# EasyEDA Pro project ProPrj_25电赛_2025-08-03-final.epro, schematic Schematic2
Board Name: Board2; Create Date: 2025-07-30; Page Name: P1; Project Name: 25电赛; Schematic Name: Schematic2; Update Date: 2025-07-30; Company: 嘉立创EDA; Page Size: A4; Version: V1.0
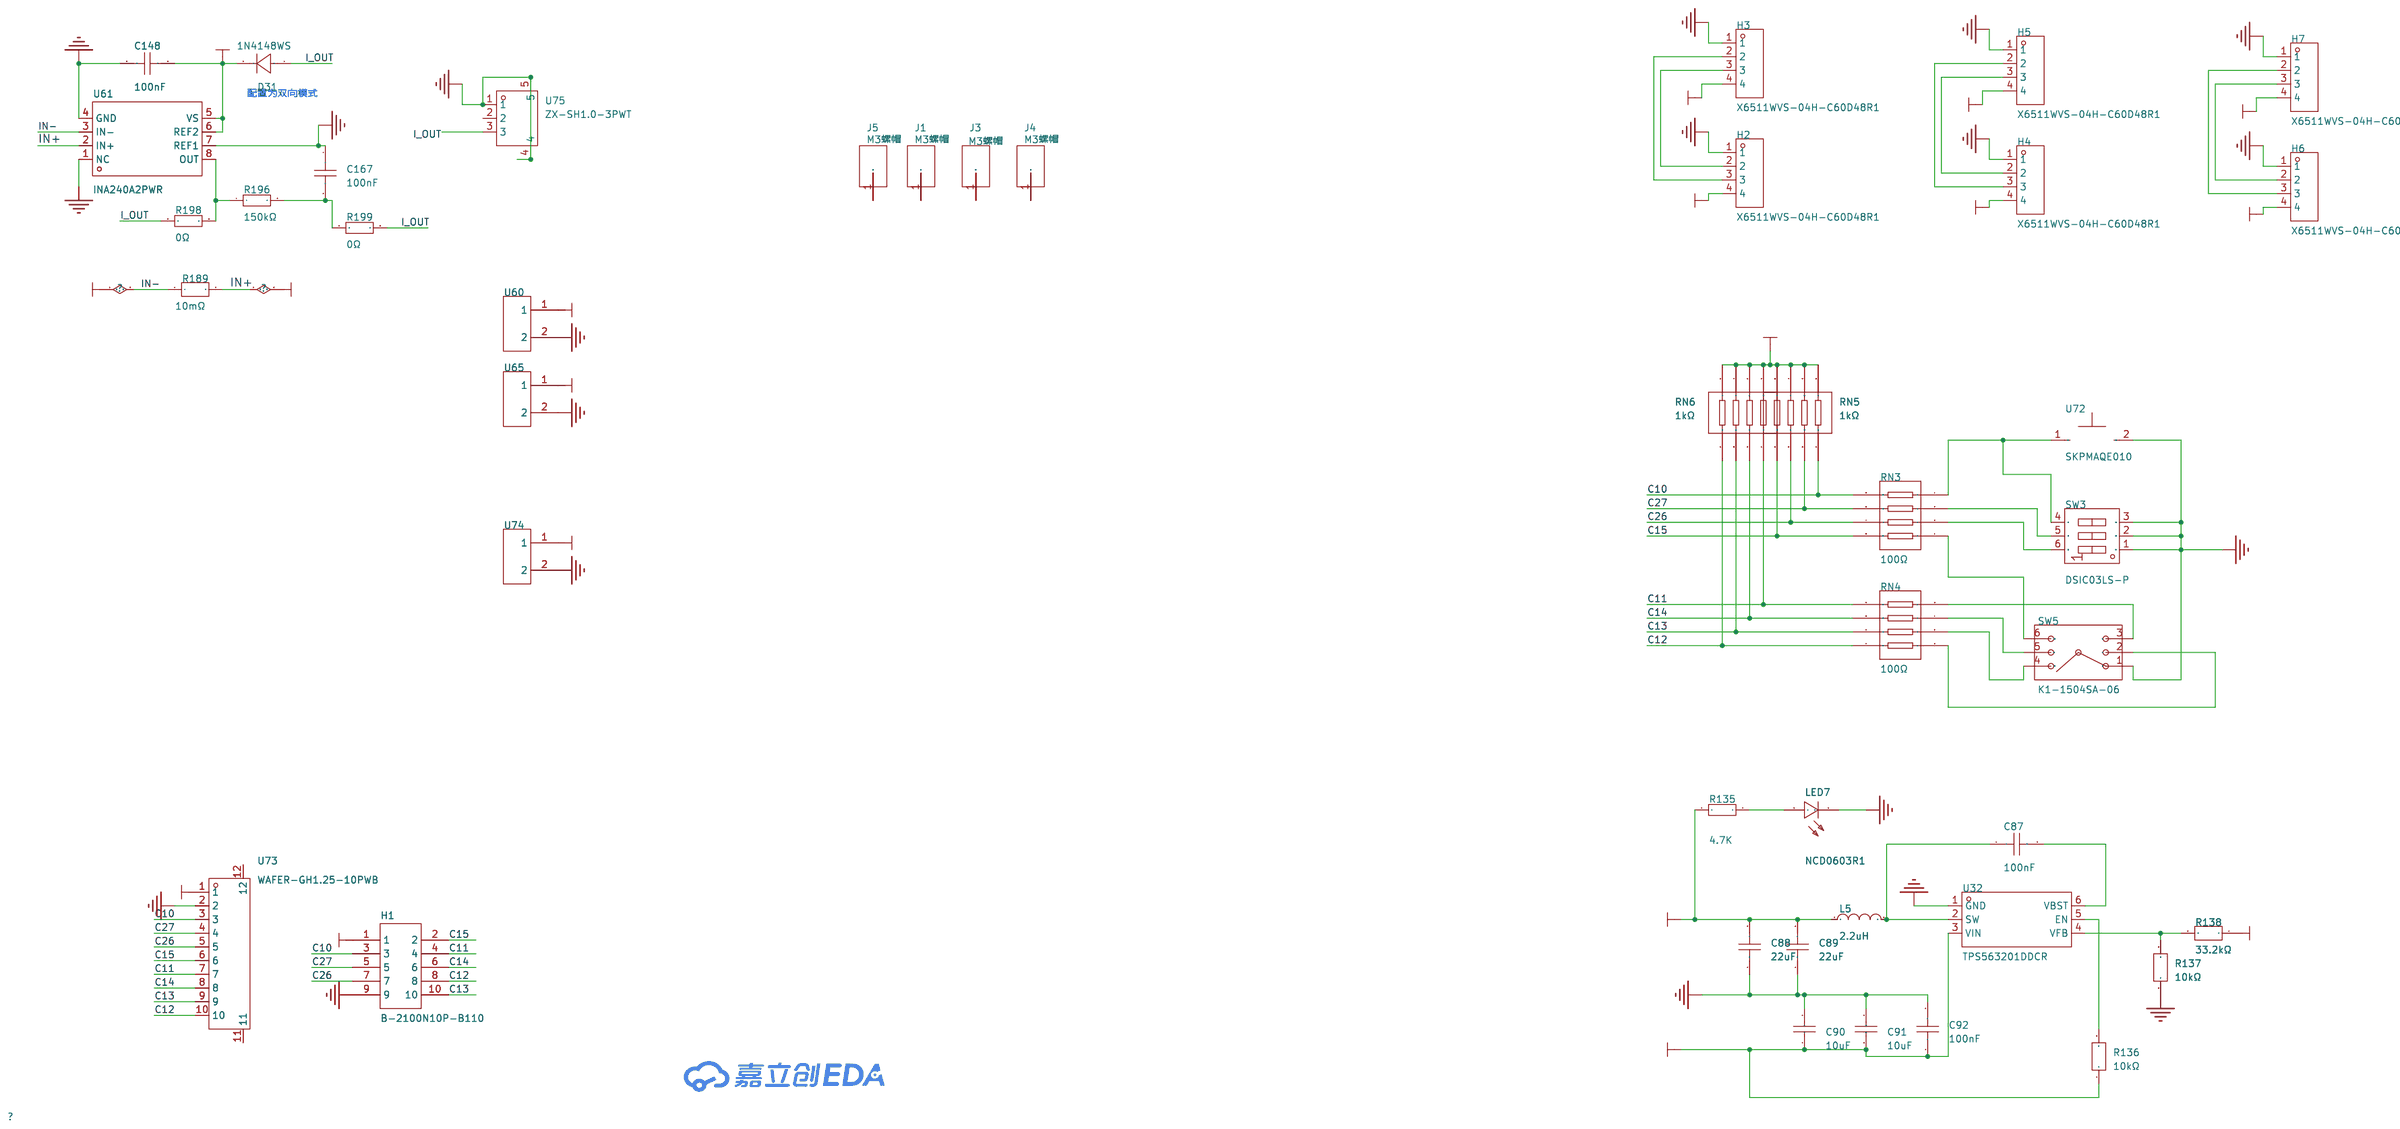
[diagram p0: schematic sheet]

## Parts
C87  100nF  [C0603]
C88  22uF  [C0805]
C89  22uF  [C0805]
C90  10uF  [C0805]
C91  10uF  [C0805]
C92  100nF  [C0603]
C148  100nF  [C0402]
C167  100nF  [C0402]
D31  1N4148WS  [SOD-323_L1.7-W1.3-LS2.5-FD]
H1  B-2100N10P-B110  [HDR-SMD_10P-P2.54-V-M-R2-C5-S2.54-LS7.3]
H2  X6511WVS-04H-C60D48R1  [HDR-SMD_4P-P2.54-V-M-S4.8]
H3  X6511WVS-04H-C60D48R1  [HDR-SMD_4P-P2.54-V-M-S4.8]
H4  X6511WVS-04H-C60D48R1  [HDR-SMD_4P-P2.54-V-M-S4.8]
H5  X6511WVS-04H-C60D48R1  [HDR-SMD_4P-P2.54-V-M-S4.8]
H6  X6511WVS-04H-C60D48R1  [HDR-SMD_4P-P2.54-V-M-S4.8]
H7  X6511WVS-04H-C60D48R1  [HDR-SMD_4P-P2.54-V-M-S4.8]
J1  M3螺帽  [M3螺帽]
J3  M3螺帽  [M3螺帽]
J4  M3螺帽  [M3螺帽]
J5  M3螺帽  [M3螺帽]
L5  2.2uH  [IND-SMD_L2.5-W2.0_MHCHL2520]
LED7  NCD0603R1  [LED0603-RD_RED]
R135  4.7K  [R0603]
R136  10kΩ  [R0603]
R137  10kΩ  [R0603]
R138  33.2kΩ  [R0603]
R189  10mΩ  [R1206]
R196  150kΩ  [R0402]
R198  0Ω  [R0603]
R199  0Ω  [R0603]
RN3  100Ω  [RES-ARRAY-SMD_0603-8P-L3.2-W1.6-BL]
RN4  100Ω  [RES-ARRAY-SMD_0603-8P-L3.2-W1.6-BL]
RN5  1kΩ  [RES-ARRAY-SMD_0603-8P-L3.2-W1.6-BL]
RN6  1kΩ  [RES-ARRAY-SMD_0603-8P-L3.2-W1.6-BL]
SW3  DSIC03LS-P  [SW-SMD_6P-L8.6-W6.2-P2.54-LS9.8]
SW5  K1-1504SA-06  [SW-SMD_K1-1504SA-06]
U32  TPS563201DDCR  [SOT-23-6_L2.9-W1.6-P0.95-LS2.8-BR]
U60  -  [2P焊接端子（大电流）]
U61  INA240A2PWR  [TSSOP-8_L4.4-W3.0-P0.65-LS6.4-BL]
U65  -  [2P焊接端子（大电流）]
U72  SKPMAQE010  [KEY-SMD_2P-L6.0-W6.0-P6.00]
U73  WAFER-GH1.25-10PWB  [CONN-SMD_10P-P1.25_XUNPU_WAFER-GH1.25-10PWB]
U74  -  [2P焊接端子（大电流）]
U75  ZX-SH1.0-3PWT  [CONN-SMD_3P-P1.00_MEGASTAR_ZX-SH1.0-3PWT]

## Library data of the parts
C87 C92 = CGA0603X7R104K500JT: 容值:100nF;精度:±10%;额定电压:50V;材质(温度系数):X7R;; LCSC Part Name: 100nF ±10% 50V; Supplier Part: C6119867; Manufacturer: HRE(芯声); Supplier Footprint: 0603; JLCPCB Part Class: 扩展库; Supplier: LCSC; Tolerance: ±10%; Voltage Rated: 50V; Temperature Coefficient: X7R
C88 C89 = CGA0805X5R226M350MT: 容值:22uF;精度:±20%;额定电压:35V;材质(温度系数):X5R;; LCSC Part Name: 22uF ±20% 35V; Supplier Part: C6119901; Manufacturer: HRE(芯声); Supplier Footprint: 0805; JLCPCB Part Class: 扩展库; Datasheet: https://atta.szlcsc.com/upload/public/pdf/source/20231129/D589D0CC4D260F7AC3A77E53B455CCB3.pdf; Supplier: LCSC; Tolerance: ±20%; Voltage Rated: 35V; Temperature Coefficient: X5R
C90 C91 = CL21A106KPFNNNE: 容值:10uF;精度:±10%;额定电压:10V;材质(温度系数):X5R;; LCSC Part Name: 10uF ±10% 10V; Supplier Part: C17024; Manufacturer: SAMSUNG(三星); Supplier Footprint: 0805; JLCPCB Part Class: 扩展库; Datasheet: https://atta.szlcsc.com/upload/public/pdf/source/20160218/1457707763339.pdf; Supplier: LCSC; Tolerance: ±10%; Voltage Rated: 10V; Temperature Coefficient: X5R
C148 C167 = CL05B104KB54PNC: 容值:100nF;精度:±10%;额定电压:50V;材质(温度系数):X7R;; LCSC Part Name: 100nF ±10% 50V; Supplier Part: C307331; Manufacturer: SAMSUNG(三星); Supplier Footprint: 0402; JLCPCB Part Class: 基础库; Datasheet: https://atta.szlcsc.com/upload/public/pdf/source/20160218/1457707763339.pdf; Supplier: LCSC; Tolerance: ±10%; Voltage Rated: 50V; Temperature Coefficient: X7R
D31 = 1N4148WS_C7420319: 二极管配置:独立式;正向压降(Vf):1.25V@150mA;直流反向耐压(Vr):100V;整流电流:150mA;反向恢复时间(trr):4ns;; Supplier Part: C7420319; Manufacturer: 宏迦橙; Supplier Footprint: SOD-323; JLCPCB Part Class: 扩展库; Datasheet: https://atta.szlcsc.com/upload/public/pdf/source/20240228/ACAE8A2B901F2FD417588BC59863BC16.pdf; Supplier: LCSC; Diode Configuration: 独立式; Forward Voltage (Vf@If): 1.25V@150mA; Reverse Voltage (Vr): 100V; Rectified Current: 150mA; Reverse Leakage Current (Ir): 1uA@75V; Reverse Recovery Time (trr): 4ns; Operating Temperature: -55℃~+150℃
H1 = B-2100N10P-B110: 插针结构:2x5P;间距:2.54mm;行距:2.54mm;圆针/方针:方针;安装方式:立贴;排数:双排;总PIN位数:10P;额定电流:-;额定电压:-;配合针长度:6mm;塑高:2mm;触头材质:黄铜;触头镀层:-;工作温度:-40℃~+105℃;颜色:黑色;; LCSC Part Name: 2x5P 间距:2.54mm 方针 立贴; Supplier Part: C124391; Manufacturer: Ckmtw(灿科盟); Supplier Footprint: SMD,P=2.54mm; JLCPCB Part Class: 扩展库; Datasheet: https://atta.szlcsc.com/upload/public/pdf/source/20170821/C124391_1503303314915901545.pdf; Supplier: LCSC; Pin Structure: 2x5P; Pitch: 2.54mm; Row Spacing: 2.54mm; Circluar Pins/Square Pins: 方针; Mounting Type: 立贴; Number of Rows: 双排; Number of Pins: 10P; Length of Mating Pin: 6mm; Insulation Height: 2mm; Contact Material: 黄铜; Operating Temperature: -40℃~+105℃; Color: 黑色
H2-H7 = X6511WVS-04H-C60D48R1: 插针结构:1x4P;间距:2.54mm;行距:2.54mm;圆针/方针:方针;安装类型:-;排数:单排;总PIN位数:4P;额定电流:3A;额定电压:250V;配合针长度:-;塑高:2.5mm;端接针长度:-;触头材质:黄铜;触头镀层:金;工作温度范围:-40℃~+105℃;焊接温度(最大值):260℃;颜色:黑色;; LCSC Part Name: 1x4P 间距:2.54mm 方针; Supplier Part: C780062; Manufacturer: XKB Connection(中国星坤); Supplier Footprint: SMD,P=2.54mm; JLCPCB Part Class: 扩展库; Datasheet: https://atta.szlcsc.com/upload/public/pdf/source/20220804/E423AB74ABBD410F84642849337C77AB.pdf; Supplier: LCSC; Pin Structure: 1x4P; Pitch: 2.54mm; Row Spacing: 2.54mm; Circluar Pins/Square Pins: 方针; Number of Rows: 单排; Number of Pins: 4P; Current Rating (Max): 3A; Voltage Rating (Max): 250V; Insulation Height: 2.5mm; Contact Material: 黄铜; Contact Plating: 金; Operating Temperature Range: -40℃~+105℃; Soldering Temperature(Max): 260℃; Color: 黑色
J1 J3-J5 = M3螺帽
L5 = FTC252012S2R2MBCA: 电感值:2.2uH;精度:±20%;额定电流:3A;饱和电流(Isat):3.8A;类型:一体成型电感;; LCSC Part Name: 2.2uH ±20% 3.8A; Supplier Part: C5832372; Manufacturer: cjiang(长江微电); Supplier Footprint: 1008; JLCPCB Part Class: 扩展库; Datasheet: https://atta.szlcsc.com/upload/public/pdf/source/20230602/8FFEDA9C0247A92A0D4B67554BFE4091.pdf; Supplier: LCSC; Tolerance: ±20%; Rated Current: 3A; Saturation Current (Isat): 3.8A; DC Resistance (DCR): 55mΩ; Type: 一体成型电感
LED7 = NCD0603R1_C84263: 灯头类型:-;发光颜色:红色;正向电压(VF):1.6V~2.6V;功率:65mW;正向电流:20mA;主波长:615nm~630nm;二极管配置:独立二极管;透镜颜色:无色透明透镜;色温:-;发光强度:80mcd~220mcd;发光角度:130°;载带方式:-;工作温度:-30℃~+85℃;; Supplier Part: C84263; Manufacturer: 国星光电; Supplier Footprint: 0603; JLCPCB Part Class: 扩展库; Datasheet: https://atta.szlcsc.com/upload/public/pdf/source/20200820/C84263_DABC6A75E58F576973B407FDBA283D60.pdf; Supplier: LCSC; Emitted Color: 红色; Forward Voltage (VF): 1.6V~2.6V; Power Dissipation: 65mW; Forward Current: 20mA; Dominant Wavelength: 615nm~630nm; Diode Configuration: 独立二极管; Lens Color: 无色透明透镜; Luminous Intensity: 80mcd~220mcd; Viewing Angle: 130°; Operating Temperature: -30℃~+85℃
R135 = Res_0603: Supplier Footprint: 0603
R136-R138 = FRC0603J103TS: 电阻类型:厚膜电阻;阻值:10kΩ;精度:±5%;功率:100mW;最大工作电压:75V;温度系数:±100ppm/℃;; LCSC Part Name: 10kΩ ±5% 100mW 厚膜电阻; Supplier Part: C2930027; Manufacturer: FOJAN(富捷); Supplier Footprint: 0603; JLCPCB Part Class: 扩展库; Datasheet: https://atta.szlcsc.com/upload/public/pdf/source/20211221/925EC7D7225764EE0046F22065062C87.pdf; Supplier: LCSC; Type: 厚膜电阻; Tolerance: ±5%; Power(Watts): 100mW; Overload Voltage (Max): 75V; Temperature Coefficient: ±100ppm/℃; Operating Temperature Range: -55℃~+155℃
R189 = JER1206F1R010: 电阻类型:采样电阻;阻值:10mΩ;精度:±1%;功率:1W;温度系数:±50ppm/℃;; LCSC Part Name: 10mΩ 1W 1206 ±1%; Supplier Part: C46634437; Manufacturer: 捷而瑞; Supplier Footprint: 1206; JLCPCB Part Class: 扩展库; Datasheet: https://atta.szlcsc.com/upload/public/pdf/source/20250318/D554CC95569B02A455FAE3D181D671EA.pdf; Supplier: LCSC; Type: 采样电阻; Tolerance: ±1%; Power(Watts): 1W; Temperature Coefficient: ±50ppm/℃
R196 = 0402WGF1503TCE: 电阻类型:厚膜电阻;阻值:150kΩ;精度:±1%;功率:62.5mW;最大工作电压:50V;温度系数:±100ppm/℃;; LCSC Part Name: 150kΩ ±1% 62.5mW 厚膜电阻; Supplier Part: C25755; Manufacturer: UNI-ROYAL(厚声); Supplier Footprint: 0402; JLCPCB Part Class: 扩展库; Datasheet: https://atta.szlcsc.com/upload/public/pdf/source/20200306/C422600_1E6D84923E4A46A82E41ADD87F860B5C.pdf; Supplier: LCSC; Type: 厚膜电阻; Tolerance: ±1%; Power(Watts): 62.5mW; Overload Voltage (Max): 50V; Temperature Coefficient: ±100ppm/℃; Operating Temperature Range: -55℃~+155℃
R198 R199 = 0603WAF0000T5E: 电阻类型:厚膜电阻;阻值:0Ω;精度:±1%;功率:100mW;工作电压:75V;; LCSC Part Name: 0Ω ±1% 100mW 厚膜电阻; Supplier Part: C21189; Manufacturer: UNI-ROYAL(厚声); Supplier Footprint: 0603; JLCPCB Part Class: 基础库; Datasheet: https://atta.szlcsc.com/upload/public/pdf/source/20200306/C422600_1E6D84923E4A46A82E41ADD87F860B5C.pdf; Supplier: LCSC; Type: 厚膜电阻; Tolerance: ±1%; Power(Watts): 100mW; Voltage-Supply(Max): 75V; Operating Temperature: -55℃~+155℃
RN3 RN4 = 4D03WGJ0101T5E: 电阻器数:4;阻值:100Ω;精度:±5%;单个元件功率:62.5mW;温度系数:±200ppm/℃;; LCSC Part Name: 100Ω ±5%; Supplier Part: C25506; Manufacturer: UNI-ROYAL(厚声); Supplier Footprint: 0603x4; JLCPCB Part Class: Extended Part; Datasheet: https://atta.szlcsc.com/upload/public/pdf/source/20191224/C474318_2527498AE30E813171187CCD28401A71.pdf; Supplier: LCSC; Number of Resistors: 4; Tolerance: ±5%; Power(Watts): 62.5mW; Temperature Coefficient: ±200ppm/℃; Number of Pins: 8
RN5 RN6 = 4D03WGJ0102T5E: 电阻器数:4;阻值:1kΩ;精度:±5%;单个元件功率:62.5mW;温度系数:±200ppm/℃;; LCSC Part Name: 1kΩ ±5%; Supplier Part: C20197; Manufacturer: UNI-ROYAL(厚声); Supplier Footprint: 0603x4; JLCPCB Part Class: 基础库; Datasheet: https://atta.szlcsc.com/upload/public/pdf/source/20191224/C474318_2527498AE30E813171187CCD28401A71.pdf; Supplier: LCSC; Number of Resistors: 4; Tolerance: ±5%; Power(Watts): 62.5mW; Temperature Coefficient: ±200ppm/℃; Number of Pins: 8
SW3 = DSIC03LS-P: 类型:平拨,凸起式;电路结构:单刀单掷;开关位数:3位;额定电流:25mA;额定电压:24V;使用寿命:3千次;颜色:黑色;; LCSC Part Name: 间距2.54mm 平拨,凸起式 3位拨码开关; Supplier Part: C319040; Manufacturer: XKB Connectivity(中国星坤); Supplier Footprint: SMD-6P,6x7.6mm; JLCPCB Part Class: 扩展库; Datasheet: https://atta.szlcsc.com/upload/public/pdf/source/20211009/004AD184124B4CBFBB0B4AFFEA8A3CC9.pdf; Supplier: LCSC; Type: 平拨,凸起式; Circuit: 单刀单掷; Number of Positions: 3位; Pin Style: 鸥翼型; Lead Pitch: 2.54mm; Current Rating: 25mA; Voltage Rating: 24V; Operating Temperature: -20℃~+70℃; Operating Life: 3千次; Color: 黑色
SW5 = K1-1504SA-06: Supplier Part: C136712; Manufacturer: 韩国韩荣; Supplier Footprint: SMD,10x10mm; JLCPCB Part Class: 扩展库; Datasheet: https://atta.szlcsc.com/upload/public/pdf/source/20210810/C19E165DEB2C09DE28F28226FC5359B8.pdf; Supplier: LCSC
U32 = TPS563201DDCR: 功能类型:降压型;输出类型:可调;输入电压:4.5V~17V;输出电压:768mV~7V;输出电流:3A;; Supplier Part: C116592; Manufacturer: TI(德州仪器); Supplier Footprint: SOT-23-THIN-6; JLCPCB Part Class: 扩展库; Datasheet: https://atta.szlcsc.com/upload/public/pdf/source/20230424/FEEFD13F14AFA838E4C009B2DDC1DFA0.pdf; Supplier: LCSC; Function: 降压型; Output Type: 可调; Input Voltage: 4.5V~17V; Output Voltage: 768mV~7V; Output Current: 3A; Switching Frequency: 580kHz; Operating Temperature: -40℃~+125℃@(TJ); Synchronous Rectification: 是; Number of Outputs: 1; Topology: 降压式; Switch tube (built-in/external): 内置
U60 U65 U74 = 大电流焊接端子
U61 = INA240A2PWR: 放大器数:单路;; Supplier Part: C129949; Manufacturer: TI(德州仪器); Supplier Footprint: TSSOP-8; JLCPCB Part Class: 扩展库; Datasheet: https://www.ti.com/cn/lit/gpn/ina240; Supplier: LCSC; Number of Channels: 单路; Supply Current: 1.8mA; Operating Temperature: -40℃~+125℃
U72 = SKPMAQE010: 6*6*5mm 立贴 硅胶软开关 无声静音开关 电路结构:单刀单掷 触点电流:50mA 额定电压(DC):16V 安装方式:立贴 动作力:3.5N 操作寿命:5万次 行程:1.3mm 用途:汽车音响,汽车导航,音响设备,手持设备,通讯设备,测量仪器等各种操作; Supplier Part: C19274389; Manufacturer: ALPSALPINE(阿尔卑斯阿尔派); Supplier Footprint: SMD,6.6x6mm; JLCPCB Part Class: 扩展库; Datasheet: https://atta.szlcsc.com/upload/public/pdf/source/20231201/D724ADF6978EA66A095344C51B88B412.pdf; Supplier: LCSC
U73 = WAFER-GH1.25-10PWB: 插针结构:1x10P;间距:1.25mm;安装方式:卧贴;参考系列:GH;总PIN数:10P;排数:1;每排PIN数:10;行距:-;额定电流:1A;触头材质:黄铜;触头镀层:-;工作温度范围:-25℃~+85℃;; LCSC Part Name: 1x10P 间距:1.25mm 卧贴 系列:GH; Supplier Part: C3029385; Manufacturer: XUNPU(讯普); Supplier Footprint: SMD,P=1.25mm,卧贴; JLCPCB Part Class: 扩展库; Datasheet: https://atta.szlcsc.com/upload/public/pdf/source/20220527/CB8773BFB0913C3B8ABD62CB38BA101A.pdf; Supplier: LCSC; Pins Structure: 1x10P; Pitch: 1.25mm; Mounting Type: 卧贴; Reference Series: GH; Number of Pins: 10P; Number of Rows: 1; Number of PINs Per Row: 10; Current Rating: 1A; Contact Material: 黄铜; Operating Temperature: -25℃~+85℃; Voltage Rating: 125V; Plastic Material: LCP; Supplementary Features: 辅助焊脚; Color: 米色; Z-Height of the Board: 4.35mm; X-Length of Bottom Edge on Board (Spacing Line): 15.75mm; Y-Width of Bottom Edge on Board: 5mm
U75 = ZX-SH1.0-3PWT: 插针结构:1x3P;间距:1mm;安装方式:卧贴;参考系列:SH;总PIN数:3P;排数:1;每排PIN数:3;行距:-;额定电流:1A;触头材质:黄铜;触头镀层:锡;工作温度:-;; LCSC Part Name: 1x3P 间距:1mm 卧贴 系列:SH; Supplier Part: C7430445; Manufacturer: Megastar(兆星); Supplier Footprint: SMD,P=1mm,卧贴; JLCPCB Part Class: 扩展库; Datasheet: https://atta.szlcsc.com/upload/public/pdf/source/20230619/CFE52D4011A035D5D140AE40938A4C7D.pdf; Supplier: LCSC; Pins Structure: 1x3P; Pitch: 1mm; Mounting Type: 卧贴; Reference Series: SH; Number of Pins: 3P; Number of Rows: 1; Number of PINs Per Row: 3; Current Rating: 1A; Contact Material: 黄铜; Contact Plating: 锡; Voltage Rating: 50V; Plastic Material: LCP; Supplementary Features: 辅助焊脚; Color: 米色; Z-Height of the Board: 3.15mm; X-Length of Bottom Edge on Board (Spacing Line): 5.35mm; Y-Width of Bottom Edge on Board: 5.05mm

## Nets
+5V_IN: R189.2 U61.2(IN+) U74.1
GND: C88.1 C89.1 C90.2 C91.2 C92.2 C148.2 C167.1 H1.9 H2.1 H3.1 H4.1 H5.1 H6.1 H7.1 LED7.1(K) R137.1 SW3.1(PIN1) SW3.2(PIN2) SW3.3(PIN3) SW5.1(A) U32.1(GND) U60.2 U61.1(NC) U61.4(GND) U61.7(REF1) U65.2 U72.2 U73.2 U74.2 U75.1 U75.4 U75.5
VCC_3V3: C88.2 C89.2 C148.1 D31.2(K) H1.1 L5.1 R135.2 R138.1 RN5.5 RN5.6 RN5.7 RN5.8 RN6.5 RN6.6 RN6.7 RN6.8 U60.1 U61.5(VS) U61.6(REF2) U73.1
VCC_5V: C90.1 C91.1 C92.1 H2.4 H3.4 H4.4 H5.4 H6.4 H7.4 R136.1 R189.1 U32.3(VIN) U61.3(IN-) U65.1
C10: H1.3 RN3.5 RN5.4 U73.3
C11: H1.4 RN4.1 RN6.4 U73.7
C12: H1.8 RN4.4 RN6.1 U73.10
C13: H1.10 RN4.3 RN6.2 U73.9
C14: H1.6 RN4.2 RN6.3 U73.8
C15: H1.2 RN3.8 RN5.1 U73.6
C26: H1.7 RN3.7 RN5.2 U73.5
C27: H1.5 RN3.6 RN5.3 U73.4
I_OUT: D31.1(A) R198.1 R199.2 U75.3
$1N2849: R196.1 R198.2 U61.8(OUT)
$1N2863: C167.2 R196.2 R199.1
$1N2955: RN3.4 SW3.4(PIN4) U72.1
$1N2956: RN3.3 SW3.5(PIN5)
$1N2957: RN3.2 SW3.6(PIN6)
$1N2958: RN3.1 SW5.6(COMMON)
$1N2959: RN4.8 SW5.3(C)
$1N2960: RN4.7 SW5.5(D)
$1N2961: RN4.6 SW5.4(CENTER)
$1N2962: RN4.5 SW5.2(B)
$1N3002: H2.3 H3.2
$1N3006: H2.2 H3.3
$1N3063: C87.1 L5.2 U32.2(SW)
$1N3066: LED7.2(A) R135.1
$1N3068: C87.2 U32.6(VBST)
$1N3069: R136.2 U32.5(EN)
$1N3071: R137.2 R138.2 U32.4(VFB)
$1N3291: H4.3 H5.2
$1N3295: H4.2 H5.3
$1N3471: H6.3 H7.2
$1N3475: H6.2 H7.3

Not connected (* = marked no-connect by the designer): J1 1; J3 1; J4 1; J5 1; U73 11 12; U75 2

## Notes on the sheet
- 配置为双向模式
